# Altium schematic sheet SH4 - GIMBDRIVE CONTROLS.SchDoc: GimbDrive Controls
size B; CheckedBy: Lance Bantoto; Engineer: Christopher Arjune; Organization: UW Robotics; Address1: 200 University Avenue; Address2: Waterloo; Address3: Ontario; Address4: Canada N2L 3G6; Revision: 1; SheetNumber: 4; SheetTotal: 6
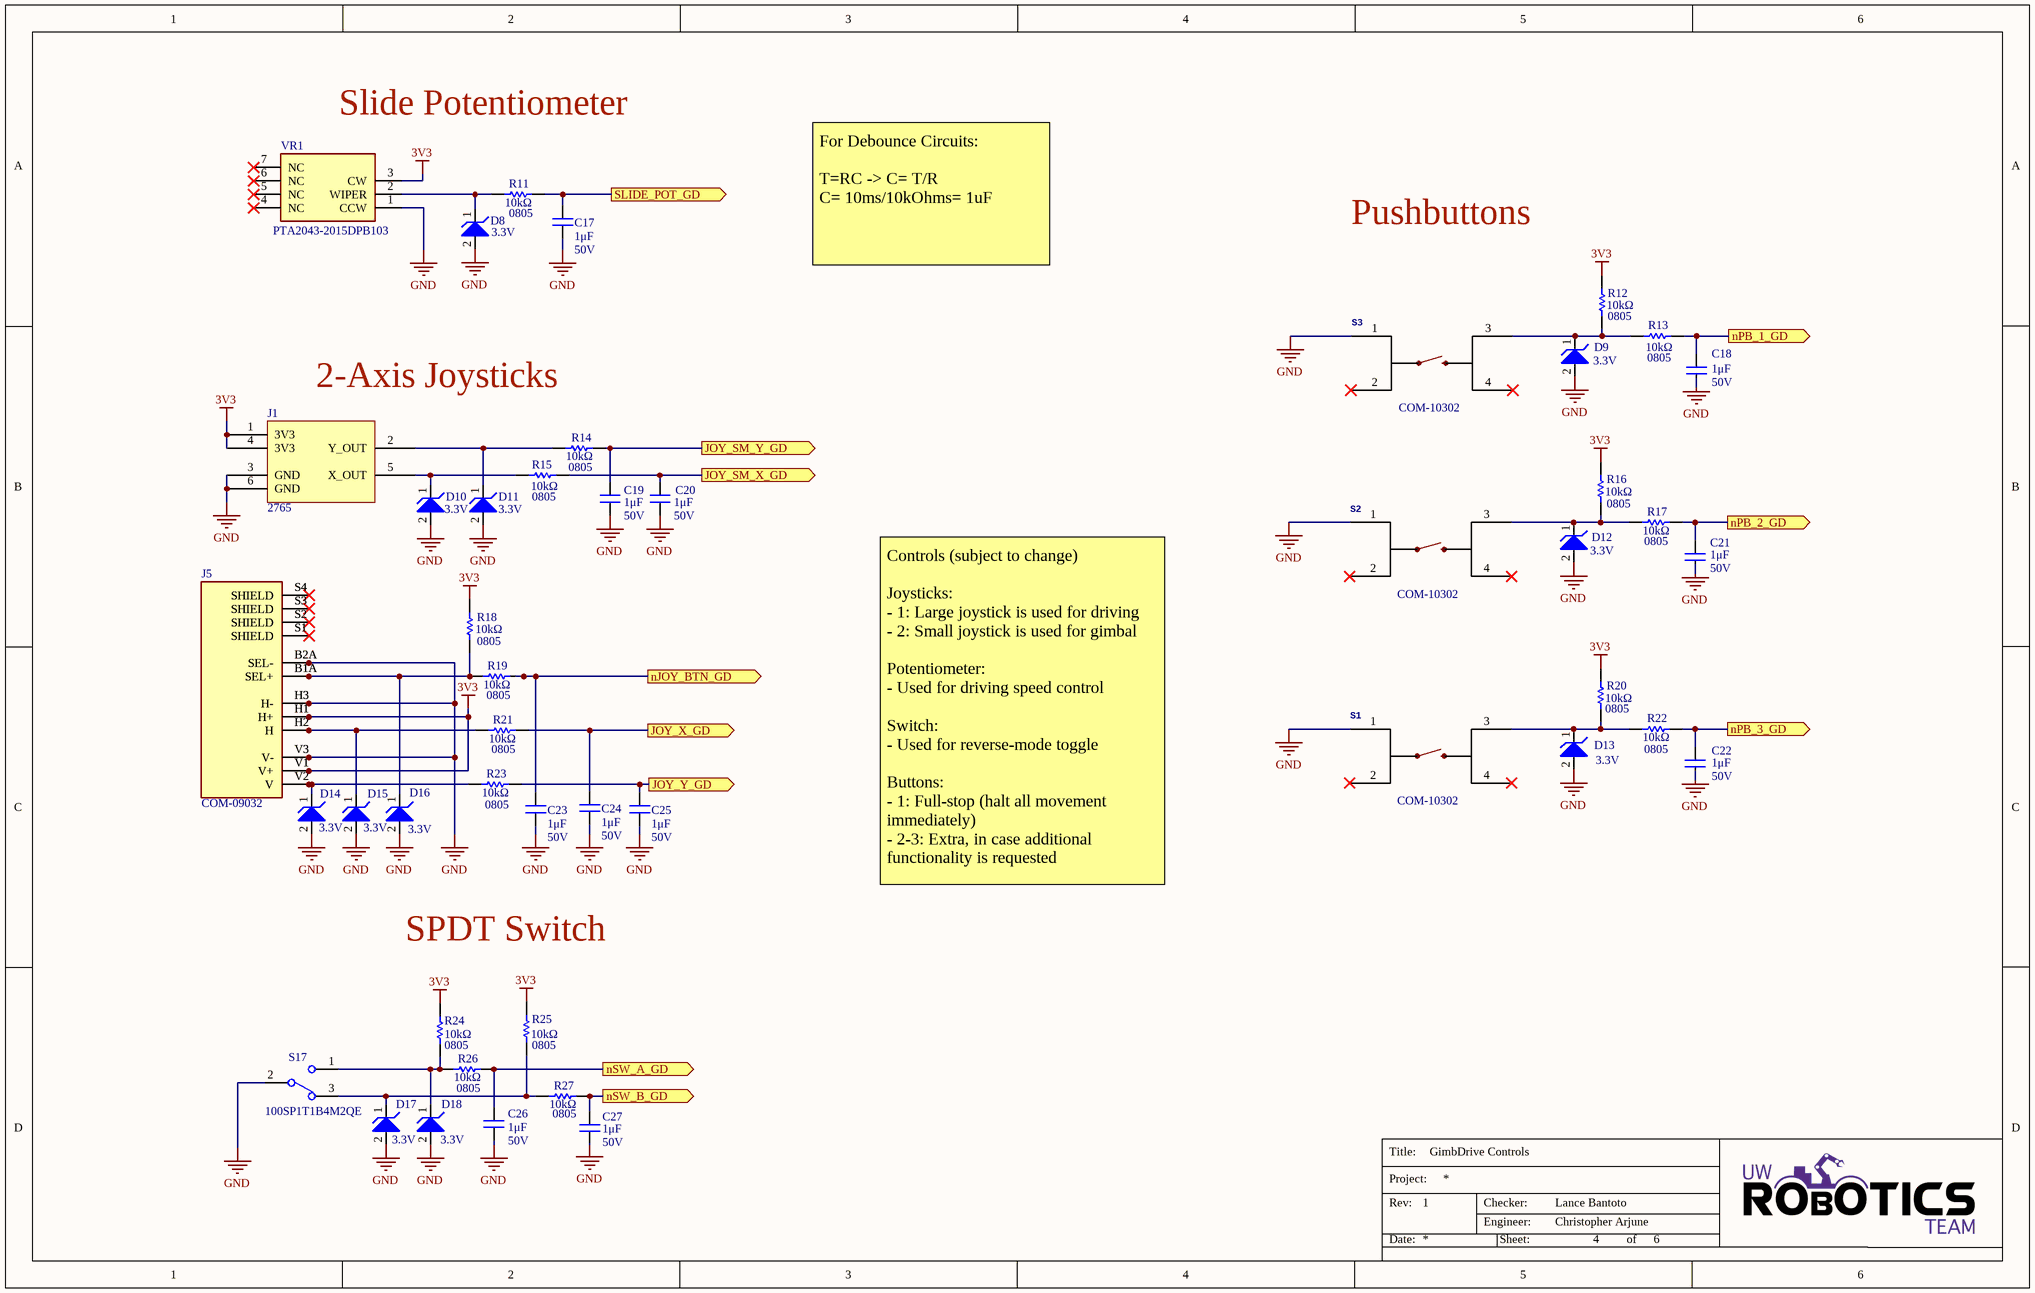
[diagram p0: SH4 - GIMBDRIVE CONTROLS.SchDoc]

## Parts
C17  value 1μF  Voltage Rating: 50V  [CAP2012]  (hidden comment: CAP_1uF_50V_0805)
C18  value 1μF  Voltage Rating: 50V  [CAP2012]  (hidden comment: CAP_1uF_50V_0805)
C19  value 1μF  Voltage Rating: 50V  [CAP2012]  (hidden comment: CAP_1uF_50V_0805)
C20  value 1μF  Voltage Rating: 50V  [CAP2012]  (hidden comment: CAP_1uF_50V_0805)
C21  value 1μF  Voltage Rating: 50V  [CAP2012]  (hidden comment: CAP_1uF_50V_0805)
C22  value 1μF  Voltage Rating: 50V  [CAP2012]  (hidden comment: CAP_1uF_50V_0805)
C23  value 1μF  Voltage Rating: 50V  [CAP2012]  (hidden comment: CAP_1uF_50V_0805)
C24  value 1μF  Voltage Rating: 50V  [CAP2012]  (hidden comment: CAP_1uF_50V_0805)
C25  value 1μF  Voltage Rating: 50V  [CAP2012]  (hidden comment: CAP_1uF_50V_0805)
C26  value 1μF  Voltage Rating: 50V  [CAP2012]  (hidden comment: CAP_1uF_50V_0805)
C27  value 1μF  Voltage Rating: 50V  [CAP2012]  (hidden comment: CAP_1uF_50V_0805)
D8  Voltage - Reverse Standoff (Typ): 3.3V  (hidden comment: TVS_DIODE_UNIDIR_3.3V)
D9  Voltage - Reverse Standoff (Typ): 3.3V  (hidden comment: TVS_DIODE_UNIDIR_3.3V)
D10  Voltage - Reverse Standoff (Typ): 3.3V  (hidden comment: TVS_DIODE_UNIDIR_3.3V)
D11  Voltage - Reverse Standoff (Typ): 3.3V  (hidden comment: TVS_DIODE_UNIDIR_3.3V)
D12  Voltage - Reverse Standoff (Typ): 3.3V  (hidden comment: TVS_DIODE_UNIDIR_3.3V)
D13  Voltage - Reverse Standoff (Typ): 3.3V  (hidden comment: TVS_DIODE_UNIDIR_3.3V)
D14  Voltage - Reverse Standoff (Typ): 3.3V  (hidden comment: TVS_DIODE_UNIDIR_3.3V)
D15  Voltage - Reverse Standoff (Typ): 3.3V  (hidden comment: TVS_DIODE_UNIDIR_3.3V)
D16  Voltage - Reverse Standoff (Typ): 3.3V  (hidden comment: TVS_DIODE_UNIDIR_3.3V)
D17  Voltage - Reverse Standoff (Typ): 3.3V  (hidden comment: TVS_DIODE_UNIDIR_3.3V)
D18  Voltage - Reverse Standoff (Typ): 3.3V  (hidden comment: TVS_DIODE_UNIDIR_3.3V)
J1  Manufacturer Part Number 1: 2765  [2_AXIS_JOYSTICK_SMALL]  (hidden comment: 2_AXIS_JOYSTICK_SMALL)
J5  Manufacturer Part Number 1: COM-09032  [2_AXIS_JOYSTICK]  (hidden comment: 2_AXIS_JOYSTICK)
R11  value 10kΩ  Package/Footprint: 0805  [RESC0805]  (hidden comment: RES_10kΩ_0805_5%)
R12  value 10kΩ  Package/Footprint: 0805  [RESC0805]  (hidden comment: RES_10kΩ_0805_5%)
R13  value 10kΩ  Package/Footprint: 0805  [RESC0805]  (hidden comment: RES_10kΩ_0805_5%)
R14  value 10kΩ  Package/Footprint: 0805  [RESC0805]  (hidden comment: RES_10kΩ_0805_5%)
R15  value 10kΩ  Package/Footprint: 0805  [RESC0805]  (hidden comment: RES_10kΩ_0805_5%)
R16  value 10kΩ  Package/Footprint: 0805  [RESC0805]  (hidden comment: RES_10kΩ_0805_5%)
R17  value 10kΩ  Package/Footprint: 0805  [RESC0805]  (hidden comment: RES_10kΩ_0805_5%)
R18  value 10kΩ  Package/Footprint: 0805  [RESC0805]  (hidden comment: RES_10kΩ_0805_5%)
R19  value 10kΩ  Package/Footprint: 0805  [RESC0805]  (hidden comment: RES_10kΩ_0805_5%)
R20  value 10kΩ  Package/Footprint: 0805  [RESC0805]  (hidden comment: RES_10kΩ_0805_5%)
R21  value 10kΩ  Package/Footprint: 0805  [RESC0805]  (hidden comment: RES_10kΩ_0805_5%)
R22  value 10kΩ  Package/Footprint: 0805  [RESC0805]  (hidden comment: RES_10kΩ_0805_5%)
R23  value 10kΩ  Package/Footprint: 0805  [RESC0805]  (hidden comment: RES_10kΩ_0805_5%)
R24  value 10kΩ  Package/Footprint: 0805  [RESC0805]  (hidden comment: RES_10kΩ_0805_5%)
R25  value 10kΩ  Package/Footprint: 0805  [RESC0805]  (hidden comment: RES_10kΩ_0805_5%)
R26  value 10kΩ  Package/Footprint: 0805  [RESC0805]  (hidden comment: RES_10kΩ_0805_5%)
R27  value 10kΩ  Package/Footprint: 0805  [RESC0805]  (hidden comment: RES_10kΩ_0805_5%)
S1  Manufacturer Part Number 1: COM-10302  [TACTILE_SWITCH_PTH_12MM]  (hidden comment: SW_MOMENTARY_PUSHBUTTON)
S2  Manufacturer Part Number 1: COM-10302  [TACTILE_SWITCH_PTH_12MM]  (hidden comment: SW_MOMENTARY_PUSHBUTTON)
S3  Manufacturer Part Number 1: COM-10302  [TACTILE_SWITCH_PTH_12MM]  (hidden comment: SW_MOMENTARY_PUSHBUTTON)
S17  SW_SPDT  [100SP1T1B4M2QE]  (value not drawn)
VR1  Manufacturer Part Number 1: PTA2043-2015DPB103  [PTA20432015CPB103]  (hidden comment: POT_10K_SLIDE)

## Ports
JOY_SM_X_GD (out), JOY_SM_Y_GD (out), JOY_X_GD (out), JOY_Y_GD (out), nJOY_BTN_GD (out), nPB_1_GD (out), nPB_2_GD (out), nPB_3_GD (out), nSW_A_GD (out), nSW_B_GD (out), SLIDE_POT_GD (out)

## Nets
3V3: J1.1(3V3) J1.4(3V3) J5.H1(H+) J5.V1(V+) R12.1 R16.1 R18.1 R20.1 R24.1 R25.1 VR1.3(CW)
GND: C17.1 C18.1 C19.1 C20.1 C21.1 C22.1 C23.1 C24.1 C25.1 C26.1 C27.1 D8.2 D9.2 D10.2 D11.2 D12.2 D13.2 D14.2 D15.2 D16.2 D17.2 D18.2 J1.3(GND) J1.6(GND) J5.B2A(SEL-) J5.H3(H-) J5.V3(V-) S1.1 S2.1 S3.1 S17.2 VR1.1(CCW)
JOY_SM_X_GD: C20.2 R15.2 ; port JOY_SM_X_GD
JOY_SM_Y_GD: C19.2 R14.2 ; port JOY_SM_Y_GD
JOY_X_GD: C24.2 R21.2 ; port JOY_X_GD
JOY_Y_GD: C25.2 R23.2 ; port JOY_Y_GD
nJOY_BTN_GD: C23.2 R19.2 ; port nJOY_BTN_GD
nPB_1_GD: C18.2 R13.2 ; port nPB_1_GD
nPB_2_GD: C21.2 R17.2 ; port nPB_2_GD
nPB_3_GD: C22.2 R22.2 ; port nPB_3_GD
nSW_A_GD: C26.2 R26.2 ; port nSW_A_GD
nSW_B_GD: C27.2 R27.2 ; port nSW_B_GD
SLIDE_POT_GD: C17.2 R11.2 ; port SLIDE_POT_GD
NetD8_1: D8.1 R11.1 VR1.2(WIPER)
NetD9_1: D9.1 R12.2 R13.1 S3.3
NetD10_1: D10.1 J1.5(X_OUT) R15.1
NetD11_1: D11.1 J1.2(Y_OUT) R14.1
NetD12_1: D12.1 R16.2 R17.1 S2.3
NetD13_1: D13.1 R20.2 R22.1 S1.3
NetD14_1: D14.1 J5.V2(V) R23.1
NetD15_1: D15.1 J5.H2(H) R21.1
NetD16_1: D16.1 J5.B1A(SEL+) R18.2 R19.1
NetD17_1: D17.1 R25.2 R27.1 S17.3
NetD18_1: D18.1 R24.2 R26.1 S17.1

Not connected (* = marked no-connect by the designer): J5 S1(SHIELD)* S2(SHIELD)* S3(SHIELD)* S4(SHIELD)*; S1 2* 4*; S2 2* 4*; S3 2* 4*; VR1 4(NC)* 5(NC)* 6(NC)* 7(NC)*

## Notes on the sheet
- (near VR1) Slide Potentiometer
- Pushbuttons
- For Debounce Circuits:
  T=RC -> C= T/R
  C= 10ms/10kOhms= 1uF
- 2-Axis Joysticks
- Controls (subject to change)
  Joysticks:
  - 1: Large joystick is used for driving
  - 2: Small joystick is used for gimbal
  Potentiometer:
  - Used for driving speed control
  Switch:
  - Used for reverse-mode toggle
  Buttons:
  - 1: Full-stop (halt all movement immediately)
  - 2-3: Extra, in case additional functionality is requested
- SPDT Switch
- Title:
- Project:
- Date:
- Rev:
- Checker:
- Engineer:
- Sheet:
- of

## Library data of the parts
C17-C27 = CAP_1uF_50V_0805: CAP CER 1UF 50V X7R 0805; Manufacturer 1: Samsung Electro-Mechanics; Manufacturer Part Number 1: CL21B105KBFNNNG; Package/Footprint: 0805; Supplier 1: Digi-Key; Supplier Part Number 1: 1276-6470-1-ND; Mounting Type: SMD; LCSC Part #: C28323
D8-D18 = TVS_DIODE_UNIDIR_3.3V: TVS DIODE 3.3V 14.1V SOD523; Manufacturer 1: ON Semiconductor; Manufacturer Part Number 1: ESD5Z3.3T1G; Package/Footprint: SOD-523; Voltage - Breakdown (Min): 5V; Supplier 1: Digi-Key; Supplier Part Number 1: ESD5Z3.3T1GOSCT-ND; Mounting Type: SMD; LCSC Part #: C61148; Voltage - Clamping (Max) @ Ipp: 14.1V
J1 = 2_AXIS_JOYSTICK_SMALL: JOYSTICK 10K OHM 2 AXIS TH; Manufacturer 1: Adafruit Industries LLC; Supplier 1: Digi-Key; Supplier Part Number 1: 1528-1730-ND; Mounting Type: TH; Package/Footprint: TH
J5 = 2_AXIS_JOYSTICK: JOYSTICK 10K OHM 2 AXIS TH; Manufacturer 1: SparkFun; Supplier 1: Digi-Key; Supplier Part Number 1: 1568-1526-ND; Verified: No; Mounting Type: TH; Package/Footprint: TH; LCSC Part #: *
R11-R27 = RES_10kΩ_0805_5%: RES 10K OHM 5% 1/8W 0805; Manufacturer 1: Panasonic Electronic Components; Manufacturer Part Number 1: ERJ-6GEYJ103V; Supplier 1: Digi-Key; Supplier Part Number 1: P10KACT-ND; LCSC Part #: C17414; Mounting Type: SMD
S1-S3 = SW_MOMENTARY_PUSHBUTTON: TACTILE MOMENTARY PUSHBUTTON SPST; Manufacturer 1: SparkFun; Package/Footprint: TH; Supplier 1: Digi-Key; Supplier Part Number 1: 1568-1332-ND; Mounting Type: TH; Verified: No
S17 = SW_SPDT: SWITCH TOGGLE SPDT 5A 120V; Manufacturer 1: E-Switch; Voltage Rating (DC): 28V; Package/Footprint: TH; Supplier 1: Digi-Key; Manufacturer Part Number 1: 100SP1T1B4M2QE; Throw Configuration: SPDT; Supplier Part Number 1: EG2355-ND; Mounting Type: TH
VR1 = POT_10K_SLIDE: SLIDE POT 10K OHM 0.1W TOP 20MM; Manufacturer 1: Bourns; Supplier 1: Digi-Key; Supplier Part Number 1: PTA2043-2015DPB103-ND